# Altium schematic sheet lcd.SchDoc
size A4
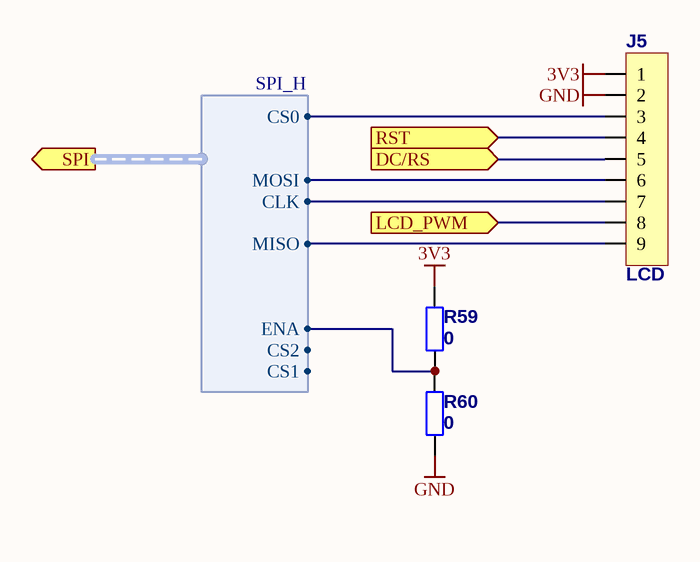
[diagram p0: lcd.SchDoc]

## Parts
J5  LCD  [GP_9x1H]
R59  0  [R0402]
R60  0  [R0402]

## Ports
DC/RS (in), LCD_PWM (in), RST (in), SPI (out, harness SPI_H)

## Harnesses
SPI_H: CLK, CS0, CS1, CS2, ENA, MISO, MOSI

## Nets
3V3: J5.1 R59.1
GND: J5.2 R60.2
DC/RS: J5.5 ; port DC/RS
LCD_PWM: J5.8 ; port LCD_PWM
RST: J5.4 ; port RST
NetJ5_3: J5.3 ; port SPI.CS0
NetJ5_6: J5.6 ; port SPI.MOSI
NetJ5_7: J5.7 ; port SPI.CLK
NetJ5_9: J5.9 ; port SPI.MISO
NetR59_2: R59.2 R60.1 ; port SPI.ENA

## Library data of the parts
J5 = CN_9x1
R59 R60 = Res: Resistor; Published: 19-Feb-2006; ComponentLink1Description: datasheet; ComponentLink2Description: supplier; Value: 0